# EAGLE design ArduinoNano LearningBot 5-14-18 (EAGLE 8.4.1)
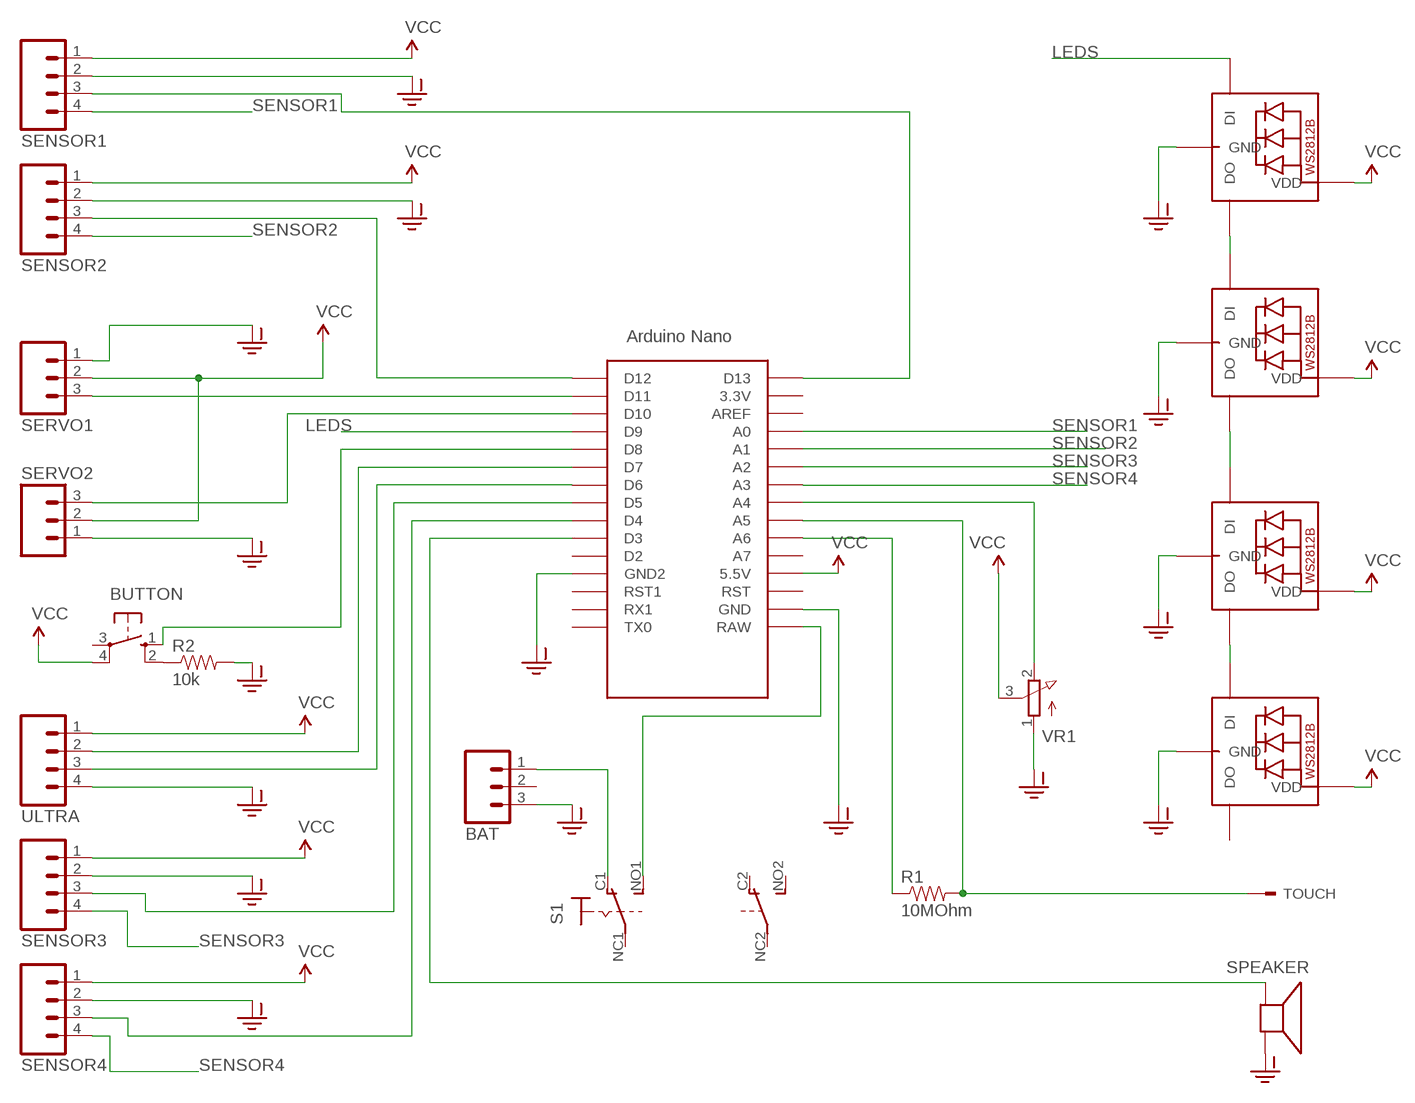
[diagram p0: schematic, sheet 1]

## Parts
BAT  M03POLAR  [MOLEX-1X3]
BUTTON  10-XX  [B3F-10XX]
LED1  WS2812B5050  [WS2812B]
LED2  WS2812B5050  [WS2812B]
LED3  WS2812B5050  [WS2812B]
LED4  WS2812B5050  [WS2812B]
R1  10MOhm  RESISTORPTH-1/4W  [AXIAL-0.4]
R2  10k  RESISTORPTH-1/4W  [AXIAL-0.4]
S1  SWITCH_320-938  [PS22F03]
SENSOR1  M04LOCK  [1X04_LOCK]
SENSOR2  M04LOCK  [1X04_LOCK]
SENSOR3  M04LOCK  [1X04_LOCK]
SENSOR4  M04LOCK  [1X04_LOCK]
SERVO1  M03LOCK  [1X03_LOCK]
SERVO2  M03LOCK  [1X03_LOCK]
SPEAKER  SPEAKER/AL60P  [AL60P]
TOUCH  TOUCHSENSOR  [TOUCH1]
U$1  ARDUINO-CLONE_NANO  [ARDUINO-CLONE_NANO]
ULTRA  M04LOCK  [1X04_LOCK]
VR1  3RP/1610N-VERTICAL  [3RP/1610N-VERTICAL]

## Nets
BUTTON: BUTTON.1(S) U$1.D8
CAP_TOUCH_RECEIVE_PIN: R1.P$1 U$1.A6
ECHO_PIN: U$1.D6 ULTRA.3
GND: BAT.3 LED1.3-GND(GND) LED2.3-GND(GND) LED3.3-GND(GND) LED4.3-GND(GND) R2.P$2 SENSOR1.2 SENSOR2.2 SENSOR3.2 SENSOR4.2 SERVO1.1 SERVO2.1 SPEAKER.1(+) U$1.GND U$1.GND1(GND2) ULTRA.4 VR1.1(A) ; supply symbol labelled GND-ISO
IR_SENSOR1_DO: SENSOR2.3 U$1.D12
IR_SENSOR2_DO: SENSOR3.3 U$1.D5
LDR1_DO: SENSOR1.3 U$1.D13
LDR2_DO: SENSOR4.3 U$1.D4
LEDS: LED1.4-DIN(DI) U$1.D9
N$1: LED2.2-DOUT(DO) LED3.4-DIN(DI)
N$3: BUTTON.2(S1) R2.P$1
N$4: LED3.2-DOUT(DO) LED4.4-DIN(DI)
N$5: LED1.2-DOUT(DO) LED2.4-DIN(DI)
POTPIN: U$1.A4 VR1.2(E)
RAWIN: S1.NO1(1:S) U$1.RAW
SENSOR1: SENSOR1.4 U$1.A0
SENSOR2: SENSOR2.4 U$1.A1
SENSOR3: SENSOR3.4 U$1.A2
SENSOR4: SENSOR4.4 U$1.A3
SERVO1: SERVO1.3 U$1.D11
SERVO2: SERVO2.3 U$1.D10
SPEAKERPIN: SPEAKER.2(-) U$1.D3
TOUCH: R1.P$2 TOUCH.P$1 U$1.A5
TRIG_PIN: U$1.D7 ULTRA.2
VCC: BUTTON.4(P1) LED1.1-VDD(VDD) LED2.1-VDD(VDD) LED3.1-VDD(VDD) LED4.1-VDD(VDD) SENSOR1.1 SENSOR2.1 SENSOR3.1 SENSOR4.1 SERVO1.2 SERVO2.2 U$1.5V(5.5V) ULTRA.1 VR1.3(S)
VIN: BAT.1 S1.C1(1:O)
Unconnected: BAT.2 BUTTON.3(P) LED4.2-DOUT(DO) S1.C2(B:O) S1.NC1(1:P) S1.NC2(B:P) S1.NO2(B:S) U$1.3.3V U$1.A7 U$1.AREF U$1.D2 U$1.RST U$1.RST1 U$1.RX1 U$1.TX0

## Library data of the parts
BAT SERVO1 SERVO2 = SparkFun-Connectors:M03: Header 3 Standard 3-pin 0.1" header. Use with straight break away headers (SKU : PRT-00116), right angle break away headers (PRT-00553), swiss pins (PRT-00743), machine pins (PRT-00117), and female headers (PRT-00115). Molex polarized connector foot print use with SKU : PRT-08232 with associated crimp pins and housings.
BUTTON = switch-omron:10-XX: OMRON SWITCH; MPN: B3F-1000; OC_FARNELL: 176432; OC_NEWARK: 36M3542
LED1-LED4 = adafruit:WS2812B
R1 R2 = SparkFun-Passives:RESISTOR: Resistor Basic schematic elements and footprints for 0603, 1206, and PTH resistors.
S1 = ArduinoNano LearningBot 4-21-18:SWITCH_320-938: TOGGLE SWITCH distributor RS Components
SENSOR1-SENSOR4 ULTRA = SparkFun-Connectors:M04: Header 4 Standard 4-pin 0.1" header. Use with straight break away headers (SKU : PRT-00116), right angle break away headers (PRT-00553), swiss pins (PRT-00743), machine pins (PRT-00117), and female headers (PRT-00115). Molex polarized connector foot print use with SKU : PRT-08231 with associated crimp pins and housings. 1MM SMD Version SKU: PRT-10208; PROD_ID: CONN-09696
SPEAKER = adafruit:SPEAKER: SPEAKER Source: Buerklin Added PS12 (for part # PS1240 piezo) http://www.ladyada.net/library/pcb/eaglelibrary.html
TOUCH = CapTouch:TOUCHSENSOR
U$1 = ArduinoNano LearningBot 3-15-18:ARDUINO-CLONE_NANO: Arduino Nano
VR1 = pot:3RP/1610N-VERTICAL: 16mm Potentiometer one level Source: http://www.alphapotentiometers.net/html/16mm_pot_2.html

## Board
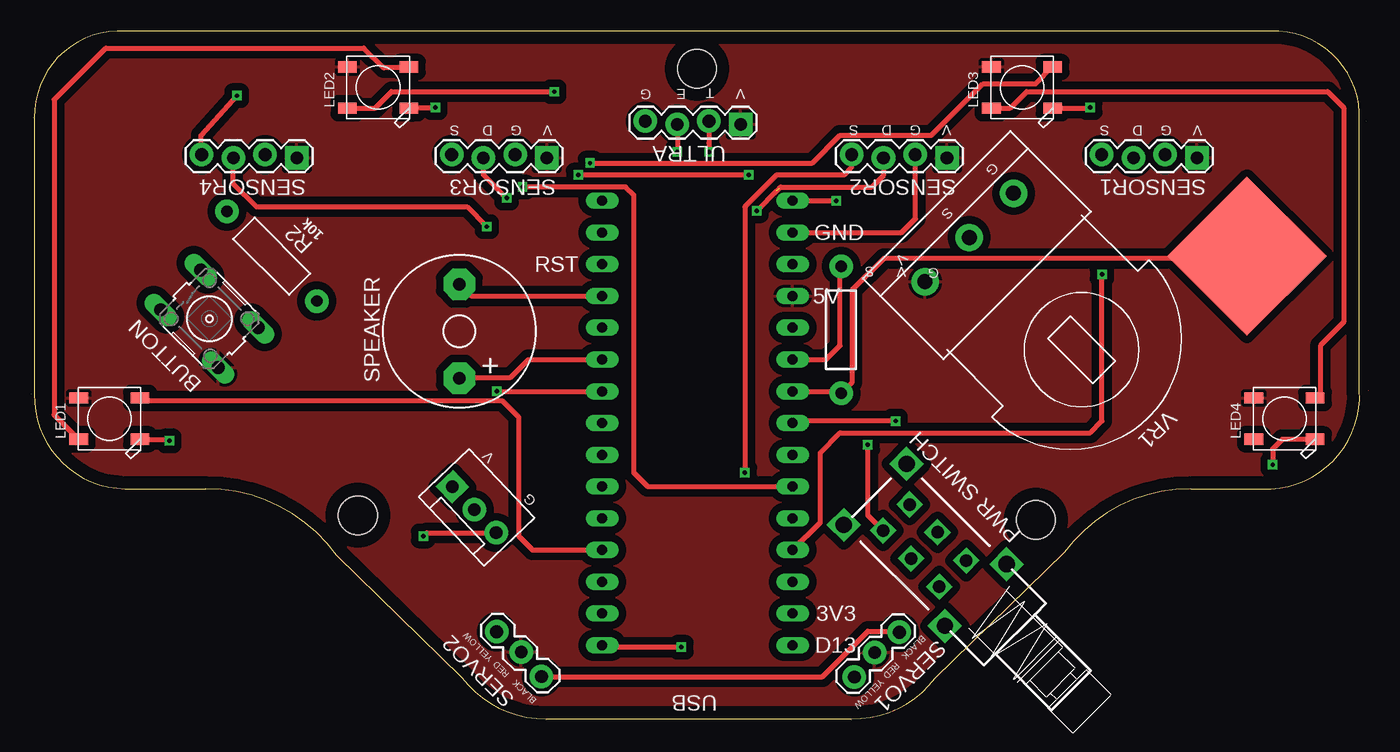
[diagram p1: board, top side]
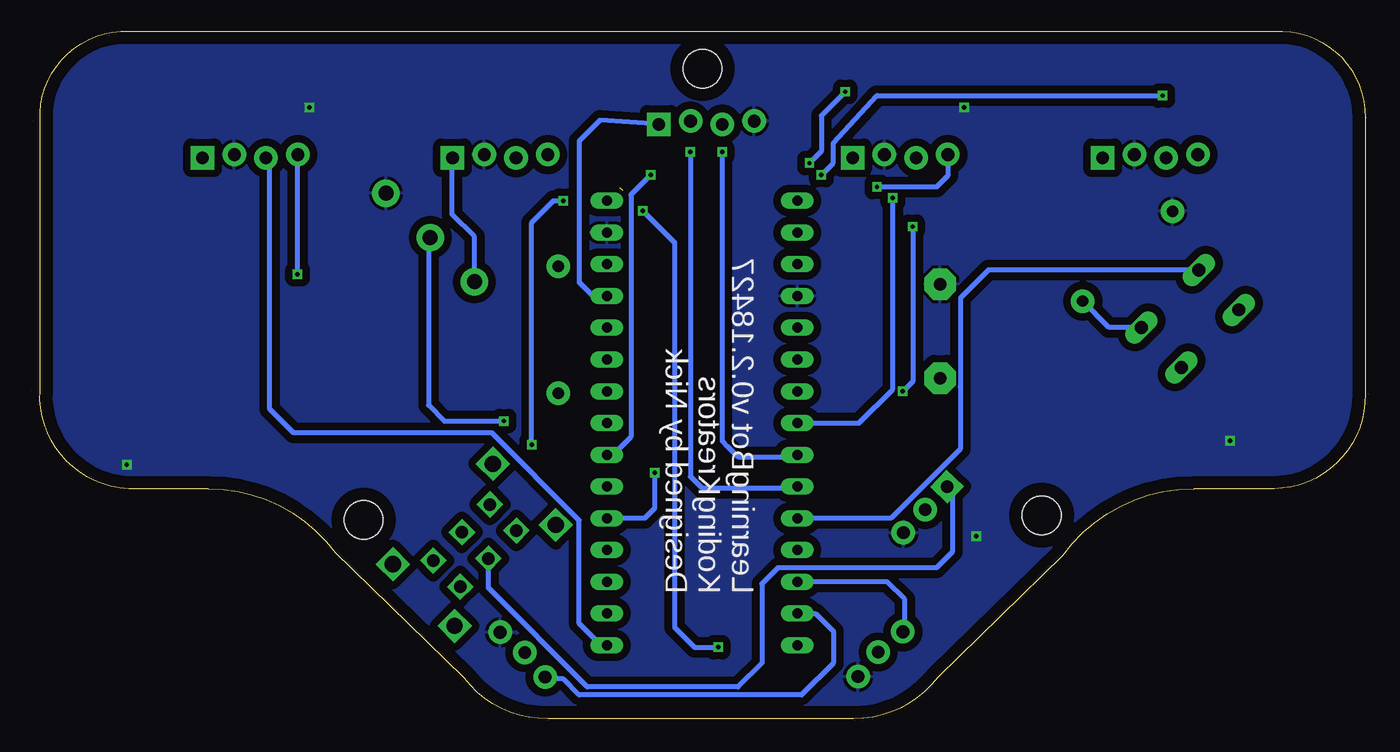
[diagram p2: board, bottom side, seen from below]

Size 106.95 x 55.14 mm. Coordinates in mm from the lower left corner, seen from the top.
Outline: 24.44,13.19 34.43,3.44
Outline: 34.43,3.44 arc-180 34.43,3.44 arc-180 34.43,3.44
Outline: 24.44,13.19 arc180 24.44,13.19 arc180 24.44,13.19
Outline: 34.43,3.44 arc54 41.19,0.14 65.6,0.14 arc54 72.31,3.4
Outline: 41.19,0 arc180 41.19,0
Outline: 65.6,0 arc180 65.6,0
Outline: 41.19,0 arc180 41.19,0
Outline: 65.6,0 arc180 65.6,0
Outline: 72.31,3.4 arc-180 72.32,3.39 arc-180 72.31,3.4
Outline: 72.31,3.4 82.63,13.42
Outline: 82.63,13.42 arc180 82.63,13.42
Outline: 92.74,18.53 arc54 82.63,13.42
Outline: 92.74,18.53 arc-180 92.74,18.53 arc-180 92.74,18.53
Outline: 82.63,13.42 arc180 82.63,13.42
Outline: 92.74,18.53 99.17,18.53
Outline: 99.17,18.53 arc-180 99.17,18.53 arc-180 99.17,18.53
Outline: 99.17,18.53 arc90 106.25,26.37 106.25,47.95 arc90 99.8,55.14 6.87,55.14 arc90 0.25,48.23 0.25,26.1 arc90 7.51,18.53
Outline: 0.18,48.23 arc180 0.18,48.23
Outline: 0.18,48.23 arc180 0.18,48.23
Outline: 7.51,18.53 arc-180 7.51,18.53 arc-180 7.51,18.53
Outline: 7.51,18.53 13.96,18.53
Outline: 13.96,18.53 arc-180 13.96,18.53 arc-180 13.96,18.53
Outline: 24.44,13.19 arc54 13.96,18.53
Outline: 106.95,26.37 arc180 106.94,26.37 arc180 106.95,26.37
Outline: 106.77,47.95 arc180 106.77,47.95 arc180 106.77,47.95
Outline: 0,26.1 arc180 0,26.1 arc180 0,26.1
Copper layers (1*16): Top 0.035mm / dielectric 1.5mm / Bottom 0.035mm
Design rules "default": minimum track width 6mil, minimum drill 0.35mm, track to track 6mil, track to pad 6mil, pad to pad 6mil, via to via 6mil, smd to smd 6mil, copper to edge 40mil, drill to drill 6mil, minimum pad ring 10mil, minimum via ring 8mil, stop-mask expansion 4mil, vias tented up to drill 0mil, thermal gap 10mil
Holes 3.1 mm at 53.25,52.14 26.13,16.41 80.35,16.03

### Footprints (pad centres in the part's own frame; a part is rotated, then mirrored left to right if it is on the bottom)
MOLEX-1X3 = drill 1.016 pad 1.88 square: 1 0,0 | drill 1.016 pad 1.88: 2 2.54,0; 3 5.08,0
B3F-10XX = drill 1.016 long: 1 -3.251,2.261; 2 3.251,2.261; 3 -3.251,-2.261; 4 3.251,-2.261
WS2812B = smd 1.5 x 0.9: 1-VDD 2.45,-1.65; 2-DOUT 2.45,1.65; 3-GND -2.45,1.65; 4-DIN -2.45,-1.65
AXIAL-0.4 = drill 0.9 pad 1.88: P$1 -5.08,0; P$2 5.08,0
PS22F03 = drill 1.3 square: 0 -3.175,5.715; 1 3.835,5.613; 2 3.81,-5.715; 3 -3.175,-5.715 | drill 1 square: C1 -1.27,0; C2 1.702,0; NC1 -1.27,-3.175; NC2 1.727,-3.226; NO1 -1.27,3.175; NO2 1.702,3.15
1X04_LOCK = drill 1.016 pad 1.88 square: 1 0,0.127 | drill 1.016 pad 1.88: 2 2.54,-0.127; 3 5.08,0.127; 4 7.62,-0.127
1X03_LOCK = drill 1.016 pad 1.88: 1 0,0.127; 2 2.54,-0.127; 3 5.08,0.127
AL60P = drill 1.016 pad 2.54 octagon: 1 -3.759,0; 2 3.759,0
TOUCH1 = smd 9 x 9: P$1 0,0
ARDUINO-CLONE_NANO = drill 0.8 long: 3.3V -10.16,24.13; 5V -10.16,-1.27; A0 -10.16,19.05; A1 -10.16,16.51; A2 -10.16,13.97; A3 -10.16,11.43; A4 -10.16,8.89; A5 -10.16,6.35; A6 -10.16,3.81; A7 -10.16,1.27; AREF -10.16,21.59; D2 5.08,1.27; D3 5.08,3.81; D4 5.08,6.35; D5 5.08,8.89; D6 5.08,11.43; D7 5.08,13.97; D8 5.08,16.51; D9 5.08,19.05; D10 5.08,21.59; D11 5.08,24.13; D12 5.08,26.67; D13 -10.16,26.67; GND -10.16,-6.35; GND1 5.08,-1.27; RAW -10.16,-8.89; RST -10.16,-3.81; RST1 5.08,-3.81; RX1 5.08,-6.35; TX0 5.08,-8.89
3RP/1610N-VERTICAL = drill 1.2 pad 2.184: 1 -5,0; 2 0,0; 3 5,0

### Placement (x,y rotation side)
BAT  33.69,18.7 313.5 top
BUTTON  14.25,32.14 315 top
LED1  6.25,24.14 180 top
LED2  27.75,50.64 180 top
LED3  79.25,50.64 180 top
LED4  100.25,24.14 180 top
R1  64.78,31.25 270 top
R2  19.25,37.14 135 top
S1  71.28,13.84 45 top
SENSOR1  93.25,45.14 180 top
SENSOR2  73.25,45.14 180 top
SENSOR3  41.25,45.14 180 top
SENSOR4  21.25,45.14 180 top
SERVO1  69.35,7.14 225 top
SERVO2  40.9,3.58 135 top
SPEAKER  34.25,31.14 270 top
TOUCH  97.25,37.14 45 top
U$1  50.75,32.68 180 top
ULTRA  56.75,47.82 180 top
VR1  75.03,38.63 225 top

### Tracks (layer width: path | path; a pad name or v marks a point on that pad's centre or on a via)
BUTTON
  Bottom 0.406: BUTTON.1 30.39,36.03 32.62,33.8 32.62,26.7 32.63,26.69 32.63,21.73 38.19,16.17 U$1.D8
CAP_TOUCH_RECEIVE_PIN
  Top 0.406: U$1.A6 63.59,28.87 64.7,29.98 64.7,36.25 R1.P$1
ECHO_PIN  (via drill 0.35)
  Top 0.406: ULTRA.3 51.68,47.99 v51.68,45.48
  Bottom 0.406: U$1.D6 45.82,21.09 50.41,21.09 51.2,21.88 51.67,22.35 51.68,22.36 v51.68,45.48
GND  (via drill 0.35, 0.35 pad 0.6)
  Top 0.406: LED4.3-GND 100.07,22.49 99.31,21.73 v99.31,20.46 | LED1.3-GND 10.92,22.49 v11.04,22.36 | LED3.3-GND 84.66,48.99 v84.7,49.03 | SERVO2.1 63.29,3.49 66.92,7.12 69.36,7.12 SERVO1.1 | v31.36,14.74 31.63,15.01 BAT.3 | U$1.GND 69.62,39.03 70.73,40.14 70.73,45.24 SENSOR2.2 | SPEAKER.1 35.19,33.95 U$1.GND1 | LED2.3-GND 30.47,48.71 30.79,49.03 v32.31,49.03
  pour Bottom (isolate 0.61): -1.21,63.53 115.63,63.53 115.63,-6.32 -1.21,-6.32
IR_SENSOR1_DO  (via drill 0.35)  (1 unrouted)
  Top 0.406: 58.98,41.73 59.83,42.58 59.94,42.68 67.24,42.68 68.19,43.63 68.19,44.98 SENSOR2.3 | 59.62,42.36 v58.03,40.78 | v52,5.85 45.82,5.85 U$1.D12
  Bottom 0.406: v58.03,40.78 55.49,38.24 55.49,7.44 53.9,5.85 v52,5.85
IR_SENSOR2_DO  (via drill 0.35)
  Top 0.406: v38.03,41.79 36.17,43.65 SENSOR3.3
  Bottom 0.406: U$1.D5 40.73,23.79 38.03,26.49 v38.03,41.79
LDR1_DO
  Bottom 0.406: SENSOR1.3 87.88,44.72 87.88,24.9 85.97,23 70.1,23 63.11,16.01 63.11,7.76 61.36,6.01 U$1.D13
LDR2_DO  (via drill 0.35)
  Top 0.406: v37.23,26.33 U$1.D4 | v36.44,39.51 34.85,41.09 18.03,41.09 16.12,43 16.12,44.96 SENSOR4.3
  Bottom 0.406: v37.23,26.33 36.44,27.12 v36.44,39.51
LEDS
  Top 0.406: 45.51,13.47 U$1.D9 40.09,13.63 38.98,14.74 38.98,24.27 37.71,25.54 8.95,25.54 LED1.4-DIN
N$1  (via drill 0.35)
  Top 0.406: LED2.2-DOUT 27.51,48.99 28.82,50.3 v41.84,50.3 | 81.62,52.21 LED3.4-DIN 80.35,50.94 76.13,50.94 72,46.81 64.7,46.81 62.48,44.59 v44.7,44.59
  Bottom 0.406: v44.7,44.59 43.74,45.54 43.74,48.4 v41.84,50.3
N$3
  Bottom 0.406: BUTTON.2 20.73,31.44 R2.P$1
N$4
  Top 0.406: LED3.2-DOUT 78.31,48.99 79.62,50.3 103.71,50.3 104.98,49.02 104.98,31.85 103.12,29.98 103.12,26.21 LED4.4-DIN
N$5
  Top 0.406: LED2.4-DIN 30.12,52.21 28.19,52.21 26.6,53.79 5.96,53.79 1.83,49.67 1.83,24.45 LED1.2-DOUT
POTPIN  (via drill 0.35)
  Top 0.406: v69.14,23.95 61.06,23.95 U$1.A4
  Bottom 0.406: VR1.2 75.18,38.49 75.18,25.22 73.91,23.95 v69.14,23.95
RAWIN  (via drill 0.35)
  Top 0.406: U$1.RAW v64.38,41.57 | S1.NO1 66.92,16.4 v66.92,22.04
  Bottom 0.406: v66.92,22.04 66.92,39.82 65.17,41.57 v64.38,41.57
SENSOR1  (via drill 0.35)
  Top 0.406: U$1.A0 63.11,15.83 63.11,21.41 64.7,23 84.7,23 85.65,23.95 v85.65,35.7
  Bottom 0.406: v85.65,35.7 85.65,45.23 SENSOR1.4
SENSOR2  (via drill 0.35)
  Top 0.406: SENSOR2.4 65.63,44.24 65.02,43.63 59.62,43.63 57.08,41.09 v57.08,19.82
  Bottom 0.406: v57.08,19.82 57.08,16.96 57.87,16.17 U$1.A1
SENSOR3  (via drill 0.35)
  Top 0.406: v39.3,42.68 47.55,42.68 48.19,42.05 48.19,19.82 49.3,18.71 U$1.A2
  Bottom 0.406: SENSOR3.4 33.63,43.59 34.54,42.68 v39.3,42.68
SENSOR4  (via drill 0.35)
  Top 0.406: SENSOR4.4 13.58,45.31 13.58,46.81 v16.44,49.98 | v57.4,43.63 v43.74,43.63
  Bottom 0.406: U$1.A3 60.41,21.25 58.98,22.68 58.98,42.05 v57.4,43.63 | v43.74,43.63 42.79,44.59 42.79,46.17 39.3,49.98 v16.44,49.98
SERVO1
  Bottom 0.406: SERVO1.3 65.7,3.31 64.38,3.31 63.11,2.04 45.33,2.04 42.79,4.58 42.79,7.12 44.22,8.55 U$1.D11
SERVO2
  Bottom 0.406: SERVO2.3 37.08,7.23 37.08,9.66 38.5,11.09 U$1.D10
SPEAKERPIN  (via drill 0.35)
  Top 0.406: v34.31,27.44 38.35,27.44 39.77,28.87 U$1.D3
  Bottom 0.406: SPEAKER.2 v34.31,27.44
TOUCH
  Top 0.406: TOUCH.P$1 97.08,36.97 68.19,36.97 65.65,34.43 65.65,27.04 R1.P$2 | 64.62,26.33 R1.P$2 | U$1.A5 64.62,26.33 | 64.62,26.33 R1.P$2
TRIG_PIN  (via drill 0.35)
  Top 0.406: ULTRA.2 54.21,46.19 54.22,46.17 v54.22,45.48
  Bottom 0.406: U$1.D7 45.82,18.55 53.27,18.55 54.06,19.34 54.22,19.5 v54.22,45.48
VCC
  Bottom 0.406: VR1.3 71.5,38.69 73.27,40.46 73.27,44.98 SENSOR2.1 | U$1.5V 62,33.95 63.11,35.06 63.11,46.35 61.45,48.01 ULTRA.1
  pour Top (isolate 0.61): -4.39,61.62 112.45,61.62 112.45,-8.23 -4.39,-8.23
VIN
  Bottom 0.406: BAT.1 33.27,18.27 33.27,13.47 34.54,12.2 47.24,12.2 48.51,10.93 48.51,4.58 50.41,2.68 62.48,2.68 70.38,10.58 S1.C1

### Text on the board
tPlace: +
tNames: G | E | T | V | S | D | G | V | S | D | G | V | S | D | G | V | G | S | V | S | V | G | V | G | PWR SWITCH | BLACK | YELLOW | RED | RED | YELLOW | BLACK | USB
bNames: LearningBot v0.2.18427 / KodingKreators / Designed by Nick